# Altium schematic sheet IC left.SchDoc
size A3
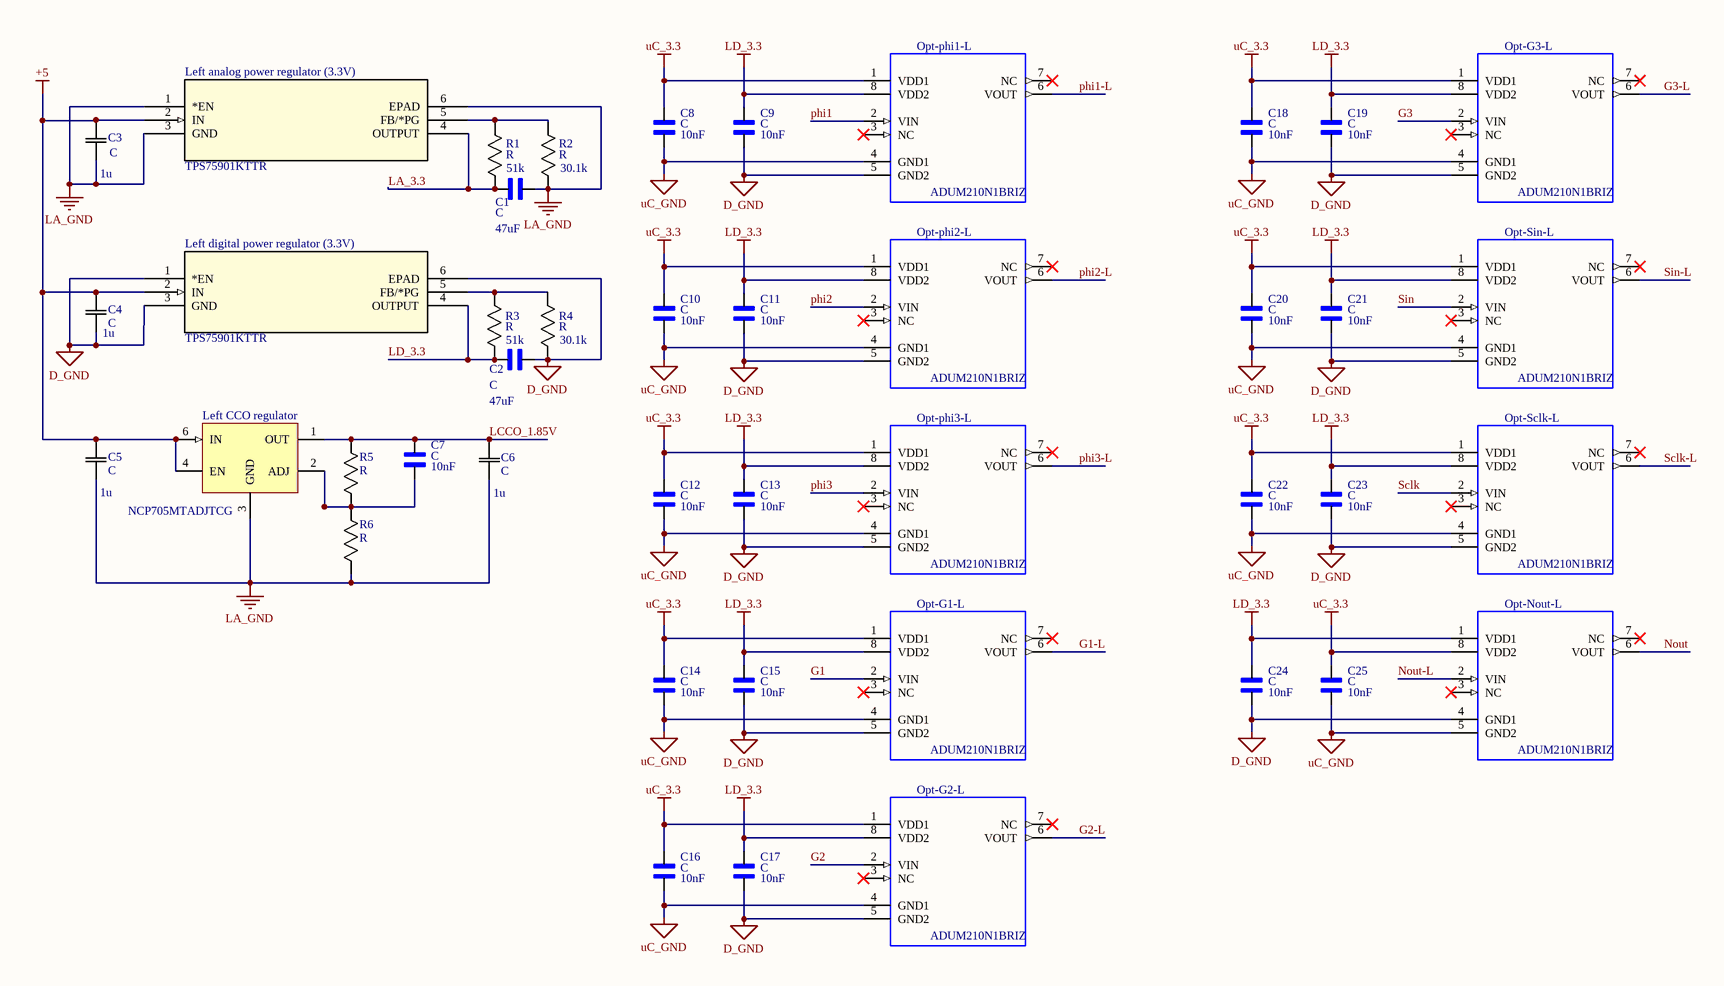
[diagram p0: IC left.SchDoc]

## Parts
C1  C  value 47uF  [CAPC1608X9N]
C2  C  value 47uF  [CAPC1608X9N]
C3  C  value 1u  [CAP_GRM_188]
C4  C  value 1u  [CAP_GRM_188]
C5  C  value 1u  [CAP_GRM_188]
C6  C  value 1u  [CAP_GRM_188]
C7  C  value 10nF  [CAPC1608X9N]
C8  C  value 10nF  [CAPC1608X9N]
C9  C  value 10nF  [CAPC1608X9N]
C10  C  value 10nF  [CAPC1608X9N]
C11  C  value 10nF  [CAPC1608X9N]
C12  C  value 10nF  [CAPC1608X9N]
C13  C  value 10nF  [CAPC1608X9N]
C14  C  value 10nF  [CAPC1608X9N]
C15  C  value 10nF  [CAPC1608X9N]
C16  C  value 10nF  [CAPC1608X9N]
C17  C  value 10nF  [CAPC1608X9N]
C18  C  value 10nF  [CAPC1608X9N]
C19  C  value 10nF  [CAPC1608X9N]
C20  C  value 10nF  [CAPC1608X9N]
C21  C  value 10nF  [CAPC1608X9N]
C22  C  value 10nF  [CAPC1608X9N]
C23  C  value 10nF  [CAPC1608X9N]
C24  C  value 10nF  [CAPC1608X9N]
C25  C  value 10nF  [CAPC1608X9N]
Left_analog_power_regulator_(3.3V)  TPS75901KTTR  [TO-263-5]
Left_CCO_regulator  NCP705MTADJTCG  [WDFN6]
Left_digital_power_regulator_(3.3V)  TPS75901KTTR  [TO-263-5]
Opt-G1-L  ADUM210N1BRIZ  [SOIC127P1150X330-8N]
Opt-G2-L  ADUM210N1BRIZ  [SOIC127P1150X330-8N]
Opt-G3-L  ADUM210N1BRIZ  [SOIC127P1150X330-8N]
Opt-Nout-L  ADUM210N1BRIZ  [SOIC127P1150X330-8N]
Opt-phi1-L  ADUM210N1BRIZ  [SOIC127P1150X330-8N]
Opt-phi2-L  ADUM210N1BRIZ  [SOIC127P1150X330-8N]
Opt-phi3-L  ADUM210N1BRIZ  [SOIC127P1150X330-8N]
Opt-Sclk-L  ADUM210N1BRIZ  [SOIC127P1150X330-8N]
Opt-Sin-L  ADUM210N1BRIZ  [SOIC127P1150X330-8N]
R1  R  value 51k  [RES_0816]
R2  R  value 30.1k  [RC0603N]
R3  R  value 51k  [RES_0816]
R4  R  value 30.1k  [RC0603N]
R5  R  [RC0603N]
R6  R  [RC0603N]

## Nets
+5: C3.2 C4.2 C5.2 Left_analog_power_regulator_(3.3V).2(IN) Left_CCO_regulator.4(EN) Left_CCO_regulator.6(IN) Left_digital_power_regulator_(3.3V).2(IN)
D_GND: C2.1 C4.1 C9.2 C11.2 C13.2 C15.2 C17.2 C19.2 C21.2 C23.2 C24.2 Left_digital_power_regulator_(3.3V).1(*EN) Left_digital_power_regulator_(3.3V).3(GND) Left_digital_power_regulator_(3.3V).6(EPAD) Opt-G1-L.5(GND2) Opt-G2-L.5(GND2) Opt-G3-L.5(GND2) Opt-Nout-L.4(GND1) Opt-phi1-L.5(GND2) Opt-phi2-L.5(GND2) Opt-phi3-L.5(GND2) Opt-Sclk-L.5(GND2) Opt-Sin-L.5(GND2) R4.2
LA_GND: C1.1 C3.1 C5.1 C6.1 Left_analog_power_regulator_(3.3V).1(*EN) Left_analog_power_regulator_(3.3V).3(GND) Left_analog_power_regulator_(3.3V).6(EPAD) Left_CCO_regulator.3(GND) R2.2 R6.2
LD_3.3: C2.2 C9.1 C11.1 C13.1 C15.1 C17.1 C19.1 C21.1 C23.1 C24.1 Left_digital_power_regulator_(3.3V).4(OUTPUT) Opt-G1-L.8(VDD2) Opt-G2-L.8(VDD2) Opt-G3-L.8(VDD2) Opt-Nout-L.1(VDD1) Opt-phi1-L.8(VDD2) Opt-phi2-L.8(VDD2) Opt-phi3-L.8(VDD2) Opt-Sclk-L.8(VDD2) Opt-Sin-L.8(VDD2) R3.1
uC_3.3: C8.1 C10.1 C12.1 C14.1 C16.1 C18.1 C20.1 C22.1 C25.1 Opt-G1-L.1(VDD1) Opt-G2-L.1(VDD1) Opt-G3-L.1(VDD1) Opt-Nout-L.8(VDD2) Opt-phi1-L.1(VDD1) Opt-phi2-L.1(VDD1) Opt-phi3-L.1(VDD1) Opt-Sclk-L.1(VDD1) Opt-Sin-L.1(VDD1)
uC_GND: C8.2 C10.2 C12.2 C14.2 C16.2 C18.2 C20.2 C22.2 C25.2 Opt-G1-L.4(GND1) Opt-G2-L.4(GND1) Opt-G3-L.4(GND1) Opt-Nout-L.5(GND2) Opt-phi1-L.4(GND1) Opt-phi2-L.4(GND1) Opt-phi3-L.4(GND1) Opt-Sclk-L.4(GND1) Opt-Sin-L.4(GND1)
G1: Opt-G1-L.2(VIN)
G1-L: Opt-G1-L.6(VOUT)
G2: Opt-G2-L.2(VIN)
G2-L: Opt-G2-L.6(VOUT)
G3: Opt-G3-L.2(VIN)
G3-L: Opt-G3-L.6(VOUT)
LA_3.3: C1.2 Left_analog_power_regulator_(3.3V).4(OUTPUT) R1.1
LCCO_1.85V: C6.2 C7.1 Left_CCO_regulator.1(OUT) R5.1
Nout: Opt-Nout-L.6(VOUT)
Nout-L: Opt-Nout-L.2(VIN)
phi1: Opt-phi1-L.2(VIN)
phi1-L: Opt-phi1-L.6(VOUT)
phi2: Opt-phi2-L.2(VIN)
phi2-L: Opt-phi2-L.6(VOUT)
phi3: Opt-phi3-L.2(VIN)
phi3-L: Opt-phi3-L.6(VOUT)
Sclk: Opt-Sclk-L.2(VIN)
Sclk-L: Opt-Sclk-L.6(VOUT)
Sin: Opt-Sin-L.2(VIN)
Sin-L: Opt-Sin-L.6(VOUT)
NetC7_2: C7.2 Left_CCO_regulator.2(ADJ) R5.2 R6.1
NetLeft_analog_power_regulator_(3.3V)_5: Left_analog_power_regulator_(3.3V).5(FB/*PG) R1.2 R2.1
NetLeft_digital_power_regulator_(3.3V)_5: Left_digital_power_regulator_(3.3V).5(FB/*PG) R3.2 R4.1

Not connected (* = marked no-connect by the designer): Opt-G1-L 3(NC)* 7(NC)*; Opt-G2-L 3(NC)* 7(NC)*; Opt-G3-L 3(NC)* 7(NC)*; Opt-Nout-L 3(NC)* 7(NC)*; Opt-phi1-L 3(NC)* 7(NC)*; Opt-phi2-L 3(NC)* 7(NC)*; Opt-phi3-L 3(NC)* 7(NC)*; Opt-Sclk-L 3(NC)* 7(NC)*; Opt-Sin-L 3(NC)* 7(NC)*

## Library data of the parts
C1 C2 = GRM188R60G476ME15D: Multilayer Ceramic Capacitors - 47uF 4V X5R 20% Pad SMD 0603 85C T/R; MF: Murata; Digi-Key_Part_Number: 490-13246-1-ND; SnapEDA_Link: https://www.snapeda.com/parts/GRM188R60G476ME15D/Murata%2520Electronics%2520North%2520America/view-part/?ref=snap; Package: 0603 Murata; Digi-Key_Purchase_URL: https://www.digikey.ca/product-detail/en/murata-electronics-north-america/GRM188R60G476ME15D/490-13246-1-ND/5877454?utm_source=snapeda&utm_medium=aggregator&utm_campaign=symbol; Manufacturer Part Number: GRM188R60G476ME15D
C3-C6 = GRM188R60J105KA0: Imported; Manufacturer Part Number: GRM188R60J105KA01D; Vendor: Murata; Built_By: EMA_UL_Team; Type: DEV; C: Copyright (C) 2015 Accelerated Designs. All rights reserved; RefDes: RefDes
C7-C25 = GRM1885C1H103JA01D: Multilayer Ceramic Capacitor, GRM Series, 0.01 F, 5%, C0G / NP0, 50 V, 0603 [1608 Metric]; MF: Murata; Package: 0603 Murata; Digi-Key_Purchase_URL: https://www.digikey.ca/product-detail/en/murata-electronics-north-america/GRM1885C1H103JA01D/490-9666-1-ND/4934772?utm_source=snapeda&utm_medium=aggregator&utm_campaign=symbol; Digi-Key_Part_Number: 490-9666-1-ND; SnapEDA_Link: https://www.snapeda.com/parts/GRM1885C1H103JA01D/Murata%20Electronics%20North%20America/view-part/?ref=snap; Manufacturer Part Number: GRM1885C1H103JA01D
Left_analog_power_regulator_(3.3V) Left_digital_power_regulator_(3.3V) = TPS75901KTTR: Imported; Vendor: Texas Instruments; Built_By: EMA_UL_Team; C: Copyright (C) 2015 Accelerated Designs. All rights reserved; Manufacturer: Texas Instruments; RefDes: RefDes; Type: DEV; Value: Value; Manufacturer Part Number: TPS75901KTTR
Left_CCO_regulator = NCP705MTADJTCG: 500 mA, Ultra-Low  Quiescent Current, IQ 13 A,  Ultra-Low Noise, LDO  Voltage Regulator; Manufacturer: ON Semiconductor; Manufacturer Part Number: NCP705MTADJTCG; Digi-Key link: https://www.digikey.ca/product-detail/en/on-semiconductor/NCP705MTADJTCG/NCP705MTADJTCGOSCT-ND/8538627
Opt-G1-L Opt-G2-L Opt-G3-L Opt-Nout-L Opt-phi1-L Opt-phi2-L Opt-phi3-L Opt-Sclk-L Opt-Sin-L = ADUM210N1BRIZ: Digital isolator 1-CH 8-Pin SOIC T/R; MF: Analog Devices; Digi-Key_Purchase_URL: https://www.digikey.ca/product-detail/en/analog-devices-inc/ADUM210N1BRIZ/ADUM210N1BRIZ-ND/6072296; Package: SOIC8; Digi-Key_Part_Number: ADUM210N1BRIZ-ND; SnapEDA_Link: https://www.snapeda.com/parts/ACPL-072L-500E/Broadcom/view-part/?ref=snap; Value: *; Manufacturer Part Number: ADUM210N1BRIZ
R1 R3 = RR0816P-513-D: Imported; Vendor: Susumu; Built_By: EMA_UL_Team; C: Copyright (C) 2015 Accelerated Designs. All rights reserved; RefDes: RefDes; Type: DEV; Manufacturer Part Number: RR0816P-513-D
R2 R4 = RT0603BRD0730K1L: Imported; Vendor: Yageo; Built_By: EMA_UL_Team; C: Copyright (C) 2015 Accelerated Designs. All rights reserved; RefDes: RefDes; Type: DEV; Manufacturer Part Number: RT0603BRD0730K1L
R5 = RC0603FR-07130KL: Imported; Vendor: Yageo; Built_By: EMA_UL_Team; Value: 130k; C: Copyright (C) 2015 Accelerated Designs. All rights reserved; RefDes: RefDes; Type: DEV; Manufacturer Part Number: RC0603FR-07130KL
R6 = ERJ-3GEY0R00V: Imported; Vendor: Panasonic; Built_By: EMA_UL_Team; Value: 98.8k; C: Copyright (C) 2015 Accelerated Designs. All rights reserved; RefDes: RefDes; Type: DEV; Manufacturer Part Number: ERJ-3GEY0R00V